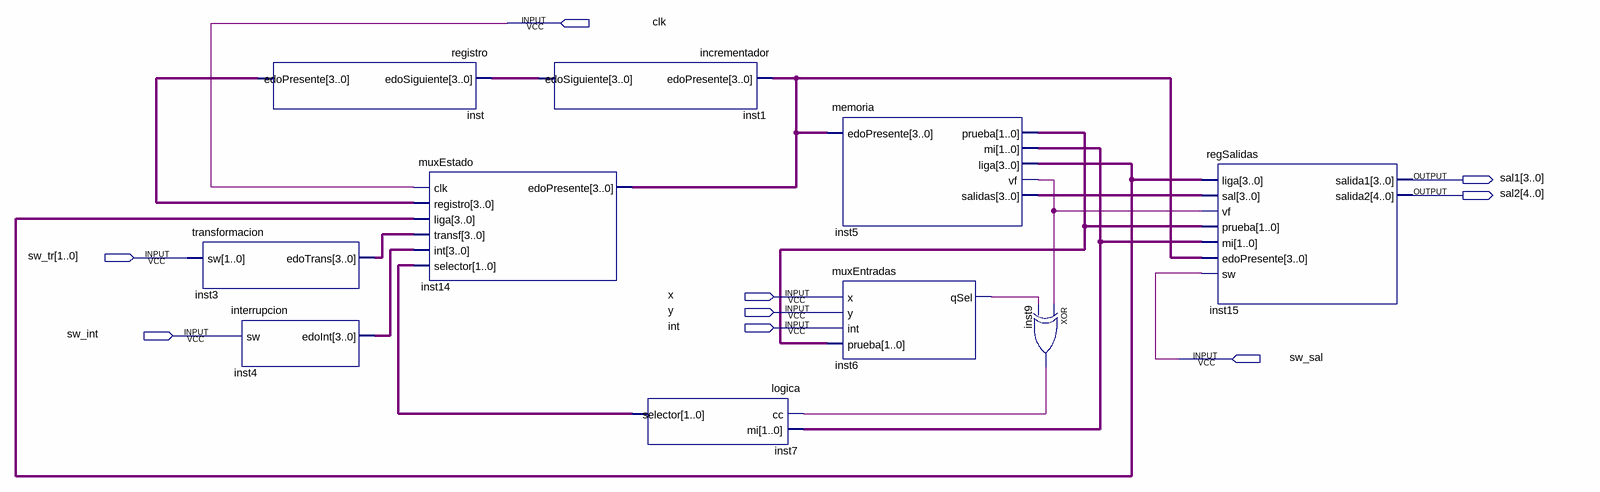
[diagram p0: schematic sheet]
// Quartus schematic practica6.bdf as structural Verilog: 10 symbols, 9 pins
module practica6 (
  input  clk,
  input  [1:0] sw_tr,
  input  x,
  input  y,
  input  \int ,
  input  sw_int,
  input  sw_sal,
  output [3:0] sal1,
  output [4:0] sal2
);

  wire inst5_vf, inst6_qsel, inst9_out;
  wire [1:0] inst5_mi, inst5_prueba, inst7_selector;
  wire [3:0] inst1_edosiguiente, inst3_edotrans, inst4_edoint, inst5_liga, inst5_salidas, inst14_edopresente,
       inst_edopresente;

  transformacion inst3 (.sw(sw_tr), .edoTrans(inst3_edotrans));
  interrupcion inst4 (.sw(sw_int), .edoInt(inst4_edoint));
  registro inst (.edoSiguiente(inst1_edosiguiente), .edoPresente(inst_edopresente));
  muxEstado inst14 (
    .clk(clk), .registro(inst_edopresente), .liga(inst5_liga), .transf(inst3_edotrans), .\int (inst4_edoint),
    .selector(inst7_selector), .edoPresente(inst14_edopresente));
  incrementador inst1 (.edoPresente(inst14_edopresente), .edoSiguiente(inst1_edosiguiente));
  logica inst7 (.cc(inst9_out), .mi(inst5_mi), .selector(inst7_selector));
  memoria inst5 (
    .edoPresente(inst14_edopresente), .prueba(inst5_prueba), .mi(inst5_mi), .liga(inst5_liga), .vf(inst5_vf),
    .salidas(inst5_salidas));
  muxEntradas inst6 (.x(x), .y(y), .\int (\int ), .prueba(inst5_prueba), .qSel(inst6_qsel));
  xor inst9 (inst9_out, inst5_vf, inst6_qsel);
  regSalidas inst15 (
    .liga(inst5_liga), .sal(inst5_salidas), .vf(inst5_vf), .prueba(inst5_prueba), .mi(inst5_mi),
    .edoPresente(inst14_edopresente), .sw(sw_sal), .salida1(sal1), .salida2(sal2));
endmodule
